# EAGLE design Obstacle Detection (EAGLE 9.6.2)
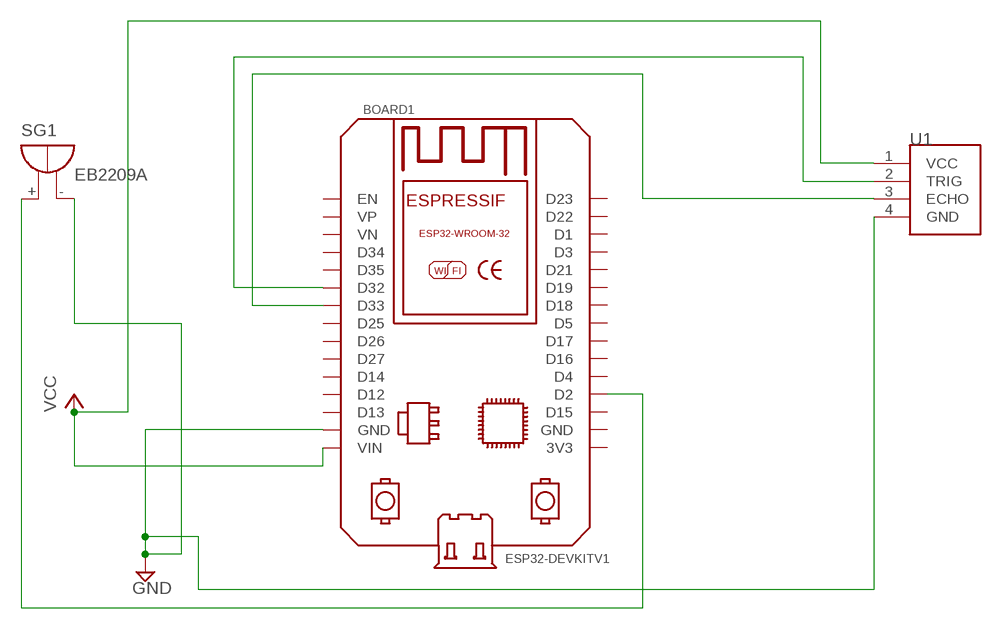
[diagram p0: schematic, sheet 1]

## Parts
BOARD1  ESP32DEVKITV1  [ESP32-DEVKITV1]
SG1  EB2209A  [EB2209A]
U1  HC-SR04  [XCVR_HC-SR04]

## Nets
GND: BOARD1.GND SG1.- U1.4(GND)
N$1: BOARD1.D32 U1.2(TRIG)
N$2: BOARD1.D33 U1.3(ECHO)
N$5: BOARD1.D2 SG1.+
VCC: BOARD1.VIN U1.1(VCC)
Unconnected: BOARD1.3V3 BOARD1.D1 BOARD1.D3 BOARD1.D4 BOARD1.D5 BOARD1.D12 BOARD1.D13 BOARD1.D14 BOARD1.D15 BOARD1.D16 BOARD1.D17 BOARD1.D18 BOARD1.D19 BOARD1.D21 BOARD1.D22 BOARD1.D23 BOARD1.D25 BOARD1.D26 BOARD1.D27 BOARD1.D34 BOARD1.D35 BOARD1.EN BOARD1.GND@1(GND) BOARD1.VN BOARD1.VP

## Library data of the parts
BOARD1 = ESP32-DEVKITV1:ESP32DEVKITV1: https://github.com/shridattdudhat
SG1 = buzzer:EB2209A: BUZZER Source: Buerklin; OC_FARNELL: unknown; OC_NEWARK: unknown
U1 = HC-SR04:HC-SR04: Check availability <https://pricing.snapeda.com/parts/HC-SR04/SparkFun%20Electronics/view-part?ref=eda>; AVAILABILITY: In Stock; CHECK_PRICES: https://www.snapeda.com/parts/HC-SR04/SparkFun/view-part/?ref=eda; DESCRIPTION: HC-SR04 Ultrasonic Sensor Qwiic Platform Evaluation Expansion Board; MF: SparkFun Electronics; MP: HC-SR04; PACKAGE: None; PRICE: None; SNAPEDA_LINK: https://www.snapeda.com/parts/HC-SR04/SparkFun/view-part/?ref=snap

## Board
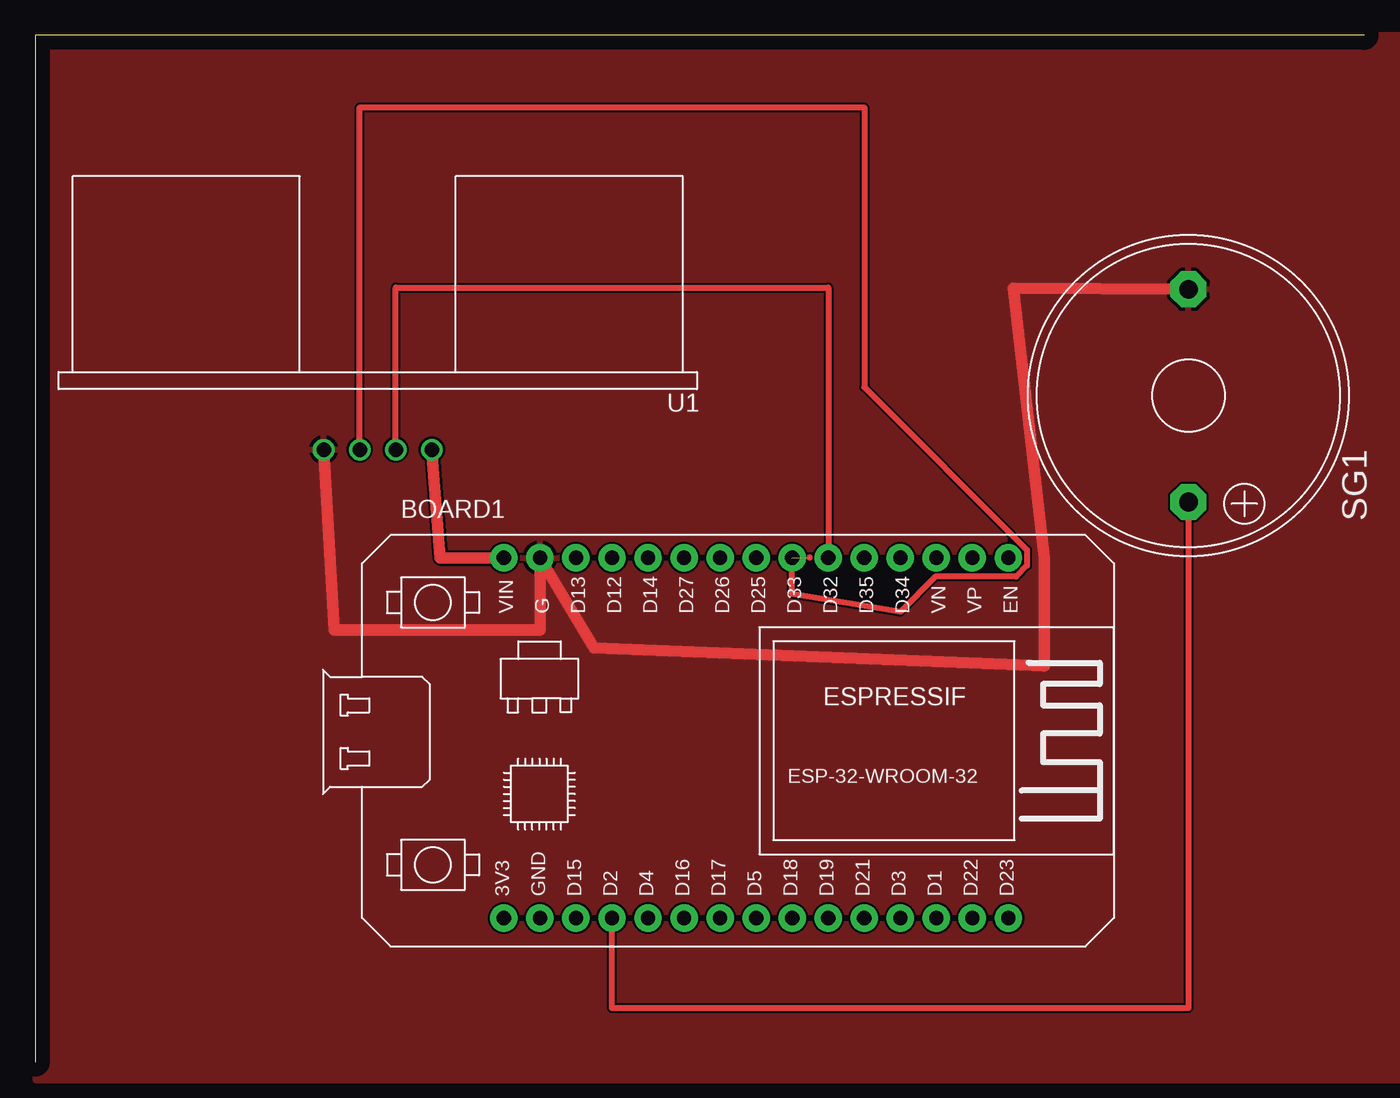
[diagram p1: board, top side]
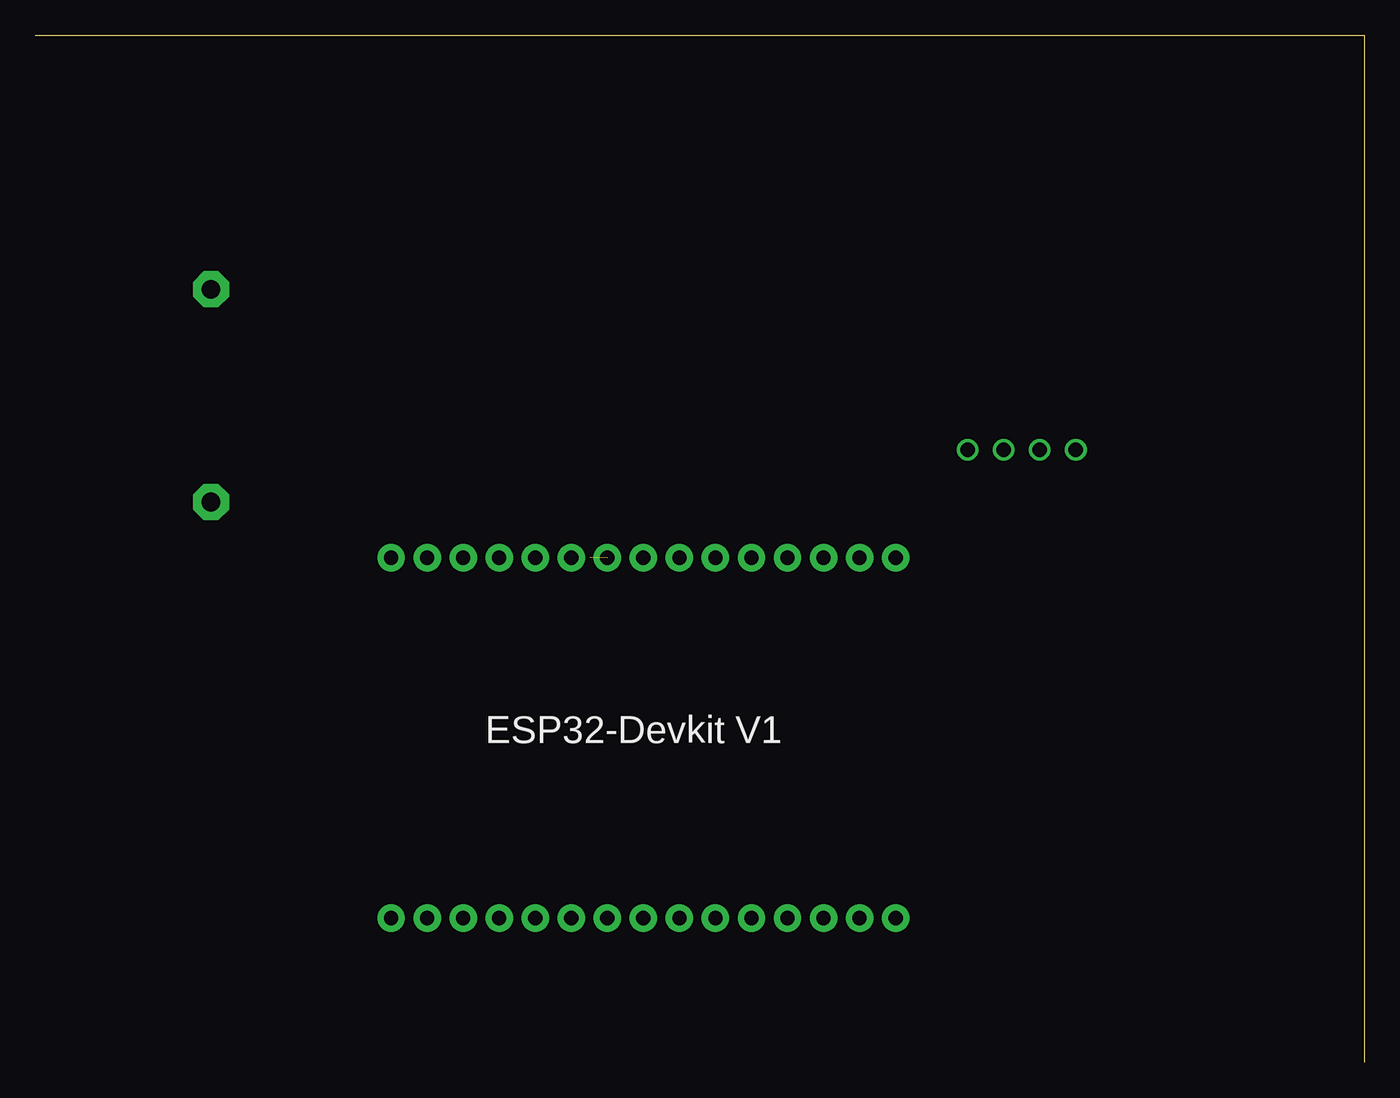
[diagram p2: board, bottom side, seen from below]

Size 93.65 x 72.38 mm. Coordinates in mm from the lower left corner, seen from the top.
Outline: 93.65,72.38 0,72.38 0,0
Copper layers (1*16): Top 0.035mm / dielectric 1.5mm / Bottom 0.035mm
Design rules "default": minimum track width 6mil, minimum drill 0.35mm, track to track 6mil, track to pad 6mil, pad to pad 6mil, via to via 6mil, smd to smd 6mil, copper to edge 40mil, drill to drill 6mil, minimum pad ring 10mil, minimum via ring 8mil, stop-mask expansion 4mil, vias tented up to drill 0mil, thermal gap 10mil

### Footprints (pad centres in the part's own frame; a part is rotated, then mirrored left to right if it is on the bottom)
ESP32-DEVKITV1 = drill 1 pad 1.93: 3V3 0,0; D1 30.48,0; D2 7.62,0; D3 27.94,0; D4 10.16,0; D5 17.78,0; D12 7.62,25.4; D13 5.08,25.4; D14 10.16,25.4; D15 5.08,0; D16 12.7,0; D17 15.24,0; D18 20.32,0; D19 22.86,0; D21 25.4,0; D22 33.02,0; D23 35.56,0; D25 17.78,25.4; D26 15.24,25.4; D27 12.7,25.4; D32 22.86,25.4; D33 20.32,25.4; D34 27.94,25.4; D35 25.4,25.4; EN 35.56,25.4; GND 2.54,25.4; GND@1 2.54,0; VIN 0,25.4; VN 30.48,25.4; VP 33.02,25.4
EB2209A = drill 1.321 pad 2.54 octagon: + 7.493,0; - -7.493,0
XCVR_HC-SR04 = drill 1.02: 1 -3.81,0; 2 -1.27,0; 3 1.27,0; 4 3.81,0

### Placement (x,y rotation side)
BOARD1  33.02,10.16 0 top
SG1  81.28,46.99 270 top
U1  24.13,43.18 180 top

### Tracks (layer width: path | path; a pad name or v marks a point on that pad's centre or on a via)
GND
  Top 0.813: U1.4 21.07,30.48 35.56,30.48 BOARD1.GND 39.37,29.21 71.12,27.94 71.12,35.56 68.93,54.57 SG1.-
  pour Top: 0,72.39 0,-1.27 99.06,-1.27 97.79,72.39 1.27,72.39
  pour Top: 0,72.39 97.79,72.39 99.06,-1.27 0,-1.27
N$1
  Top 0.406: U1.2 25.4,54.61 55.88,54.61 BOARD1.D32
N$2  (1 unrouted)
  Top 0.406: 54.56,35.59 54.56,35.56 | U1.3 22.86,67.31 58.42,67.31 58.42,47.59 69.9,36.11 69.9,35.01 69.13,34.24 63.45,34.24 60.96,31.75 53.34,33.02 BOARD1.D33
N$5
  Top 0.406: SG1.+ 81.28,3.81 40.64,3.81 BOARD1.D2
VCC
  Top 0.813: U1.1 28.53,35.56 BOARD1.VIN